# EAGLE design v2.0 Door (EAGLE 7.7.0)

## Sheet 1 of 2
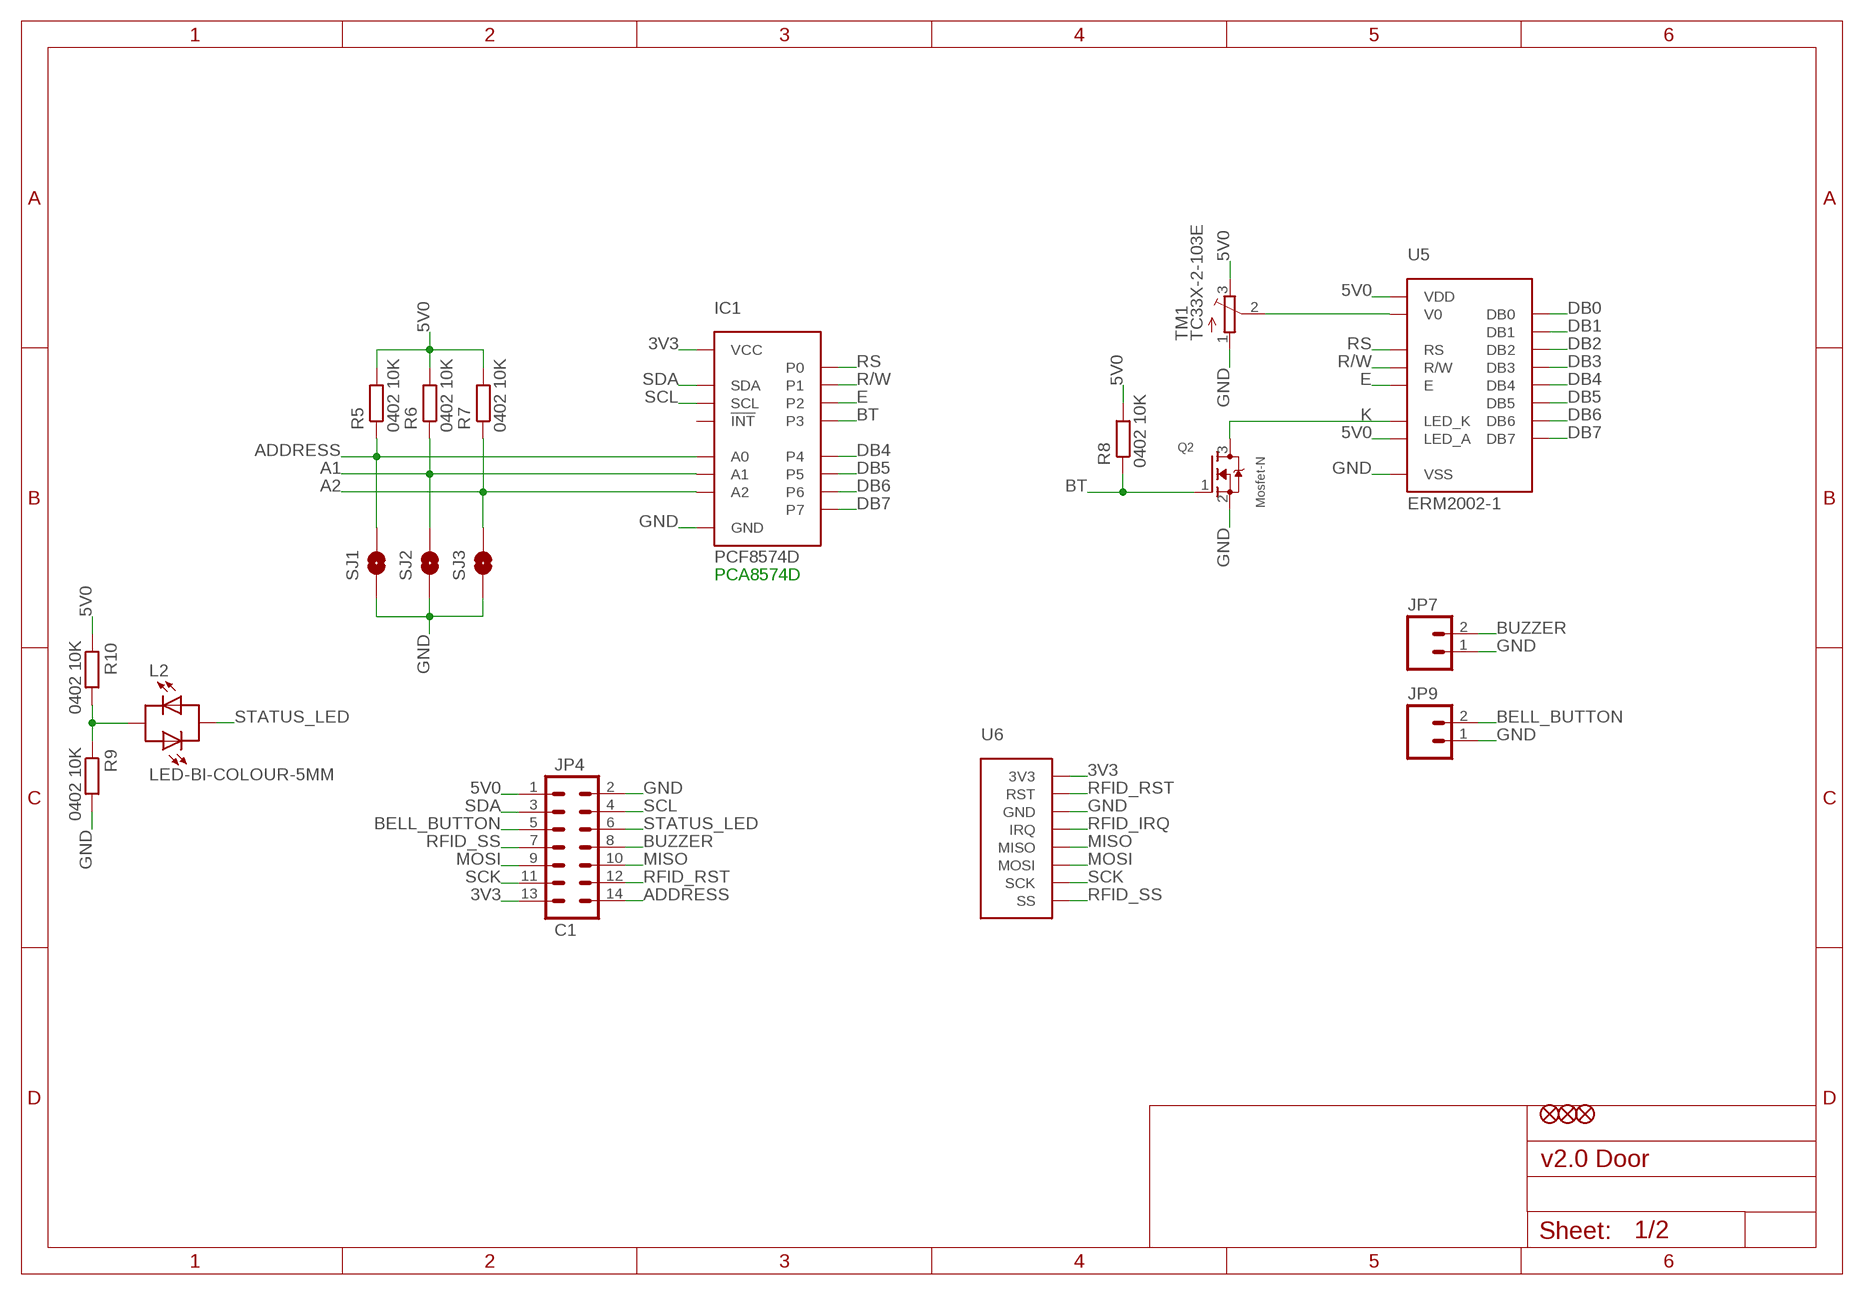
[diagram p0: schematic, sheet 1]

### Parts
IC1  PCF8574D  PCF8574  [SO16]
JP1  FIDUCIAL1X2.5-STOP  [FIDUCIAL-1X2.5-STOP]
JP2  FIDUCIAL1X2.5-STOP  [FIDUCIAL-1X2.5-STOP]
JP3  FIDUCIAL1X2.5-STOP  [FIDUCIAL-1X2.5-STOP]
JP4  C1  M07X2-SHOROUDED_LOCK  [2X7-SHROUDED_LOCK]
JP7  M02POLAR_LOCK  [MOLEX-1X2_LOCK]
JP9  M02POLAR_LOCK  [MOLEX-1X2_LOCK]
L2  LED-BI-COLOUR-5MM  [LED5MM]
Q2  Mosfet-N  MOSFET-N-SOT23-SPARK  [SOT23-3]
R5  0402 10K  R-EU_R0402-SMALLER  [R0402-SMALLER]
R6  0402 10K  R-EU_R0402-SMALLER  [R0402-SMALLER]
R7  0402 10K  R-EU_R0402-SMALLER  [R0402-SMALLER]
R8  0402 10K  R-EU_R0402-SMALLER  [R0402-SMALLER]
R9  0402 10K  R-EU_R0402-SMALLER  [R0402-SMALLER]
R10  0402 10K  R-EU_R0402-SMALLER  [R0402-SMALLER]
SJ1  SOLDERJUMPERNO  [SJ_2S-NO]
SJ2  SOLDERJUMPERNO  [SJ_2S-NO]
SJ3  SOLDERJUMPERNO  [SJ_2S-NO]
TM1  TC33X-2-103E  TRIMPOTTC33X  [TC33X]
U5  ERM2002-1  ERM2002-1-GATEKEEPER  [ERM2002-1-GATEKEEPER]
U6  RFID-RC522-GATEKEEPER  [RFID-RC522-GATEKEEPER]

### Nets
3V3: IC1.16(VCC) JP4.13 U6.8(3V3)
5V0: JP4.1 R5.2 R6.2 R7.2 R8.2 R10.1 TM1.3(E) U5.2(VDD) U5.15(LED_A)
A1: IC1.2(A1) R6.1 SJ2.2
A2: IC1.3(A2) R7.1 SJ3.2
ADDRESS: IC1.1(A0) JP4.14 R5.1 SJ1.2
BELL_BUTTON: JP4.5 JP9.2
BT: IC1.7(P3) Q2.1(G) R8.1
BUZZER: JP4.8 JP7.2
DB0: U5.7(DB0)
DB1: U5.8(DB1)
DB2: U5.9(DB2)
DB3: U5.10(DB3)
DB4: IC1.9(P4) U5.11(DB4)
DB5: IC1.10(P5) U5.12(DB5)
DB6: IC1.11(P6) U5.13(DB6)
DB7: IC1.12(P7) U5.14(DB7)
E: IC1.6(P2) U5.6(E)
GND: IC1.8(GND) JP4.2 JP7.1 JP9.1 Q2.2(S) R9.2 SJ1.1 SJ2.1 SJ3.1 TM1.1(A) U5.1(VSS) U6.6(GND) ; also sheet 2
K: Q2.3(D) U5.16(LED_K)
MISO: JP4.10 U6.4(MISO)
MOSI: JP4.9 U6.3(MOSI)
N$8: TM1.2(S) U5.3(V0)
N$9: L2.A R9.1 R10.2
R/W: IC1.5(P1) U5.5(R/W)
RFID_IRQ: U6.5(IRQ)
RFID_RST: JP4.12 U6.7(RST)
RFID_SS: JP4.7 U6.1(SS)
RS: IC1.4(P0) U5.4(RS)
SCK: JP4.11 U6.2(SCK)
SCL: IC1.14(SCL) JP4.4
SDA: IC1.15(SDA) JP4.3
STATUS_LED: JP4.6 L2.K
Unconnected: IC1.13(!INT)

### Notes on the sheet
- PCA8574D

## Sheet 2 of 2
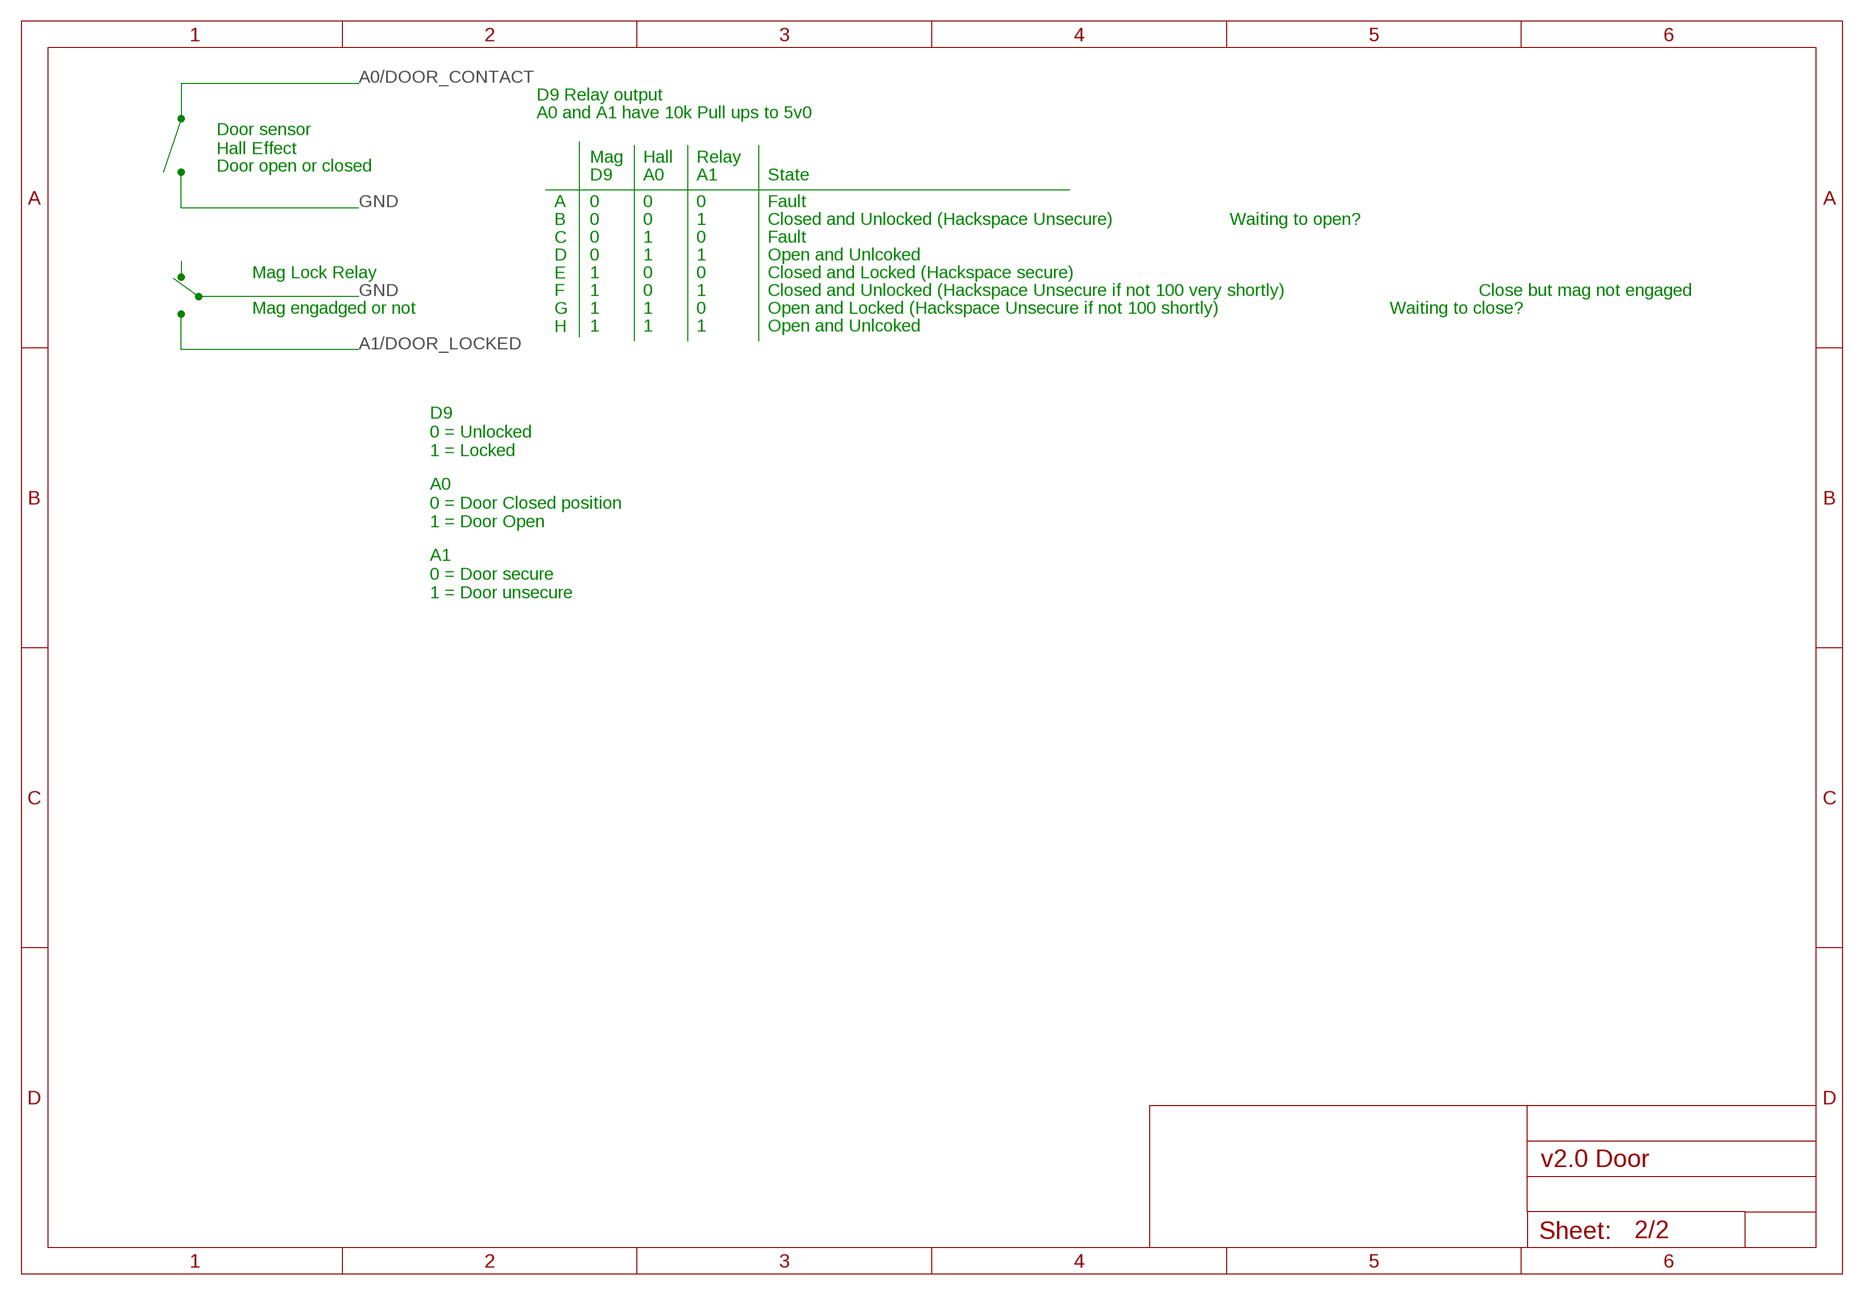
[diagram p1: schematic, sheet 2]

### Notes on the sheet
- D9 Relay output
- A0 and A1 have 10k Pull ups to 5v0
- Door sensor
  Hall Effect
- Mag | Hall | Relay
- Door open or closed
- D9 | A0 | A1 | State
- 0 | 0 | 0 | Fault
- 0 | 0 | 1 | Closed and Unlocked (Hackspace Unsecure) | Waiting to open?
- 0 | 1 | 0 | Fault
- 0 | 1 | 1 | Open and Unlcoked
- Mag Lock Relay | 1 | 0 | 0 | Closed and Locked (Hackspace secure)
- 1 | 0 | 1 | Closed and Unlocked (Hackspace Unsecure if not 100 very shortly) | Close but mag not engaged
- Mag engadged or not | 1 | 1 | 0 | Open and Locked (Hackspace Unsecure if not 100 shortly) | Waiting to close?
- A
  B
  C
  D
  E
  F
  G
  H
- 1 | 1 | 1 | Open and Unlcoked
- D9
  0 = Unlocked
  1 = Locked
- A0
  0 = Door Closed position
  1 = Door Open
- A1
  0 = Door secure
  1 = Door unsecure

## Library data of the parts
IC1 = CISECO eaglecad designs:PCF8574
JP1-JP3 = CISECO eaglecad designs:FIDUCIAL: Fiducial Alignment Points Various fiducial points for machine vision alignment.
JP4 = CISECO eaglecad designs:M07X2
JP7 JP9 = CISECO eaglecad designs:M02: Header 2 Standard 2-pin 0.1" header. Use with straight break away headers (SKU : PRT-00116), right angle break away headers (PRT-00553), swiss pins (PRT-00743), machine pins (PRT-00117), and female headers (PRT-00115). Molex polarized connector foot print use with SKU : PRT-08233 with associated crimp pins and housings.
L2 = CISECO eaglecad designs:LED-BI-COLOUR
Q2 = TiLDA Mk2 Parts:MOSFET-N: N-Channel Mosfet 2N7002E - 60V 260mA SOT23 [Digikey: 2N7002ET1GOSTR-ND] - REEL BSH103 - 30V 850mA SOT23 [Digikey: 568-5013-1-ND]
R5-R10 = CISECO eaglecad designs:R-EU_: RESISTOR, European symbol
SJ1-SJ3 = CISECO eaglecad designs:SOLDERJUMPER: Solder Jumper Standard SMD solder jumper. Used to automate production. Two varients : Normally Open and Normally Closed are the same, but have different paste layers. NC will have a large amount of paste and should jumper during reflow.
TM1 = adafruit 161207:TRIMPOT: SMT trimmer potentiometer part number TC33X http://www.ladyada.net/library/eagle
U5 = CISECO eaglecad designs:ERM2002-1
U6 = CISECO eaglecad designs:RFID-RC522

## Net classes
2 MAINS: clearance 4 mm

## Board
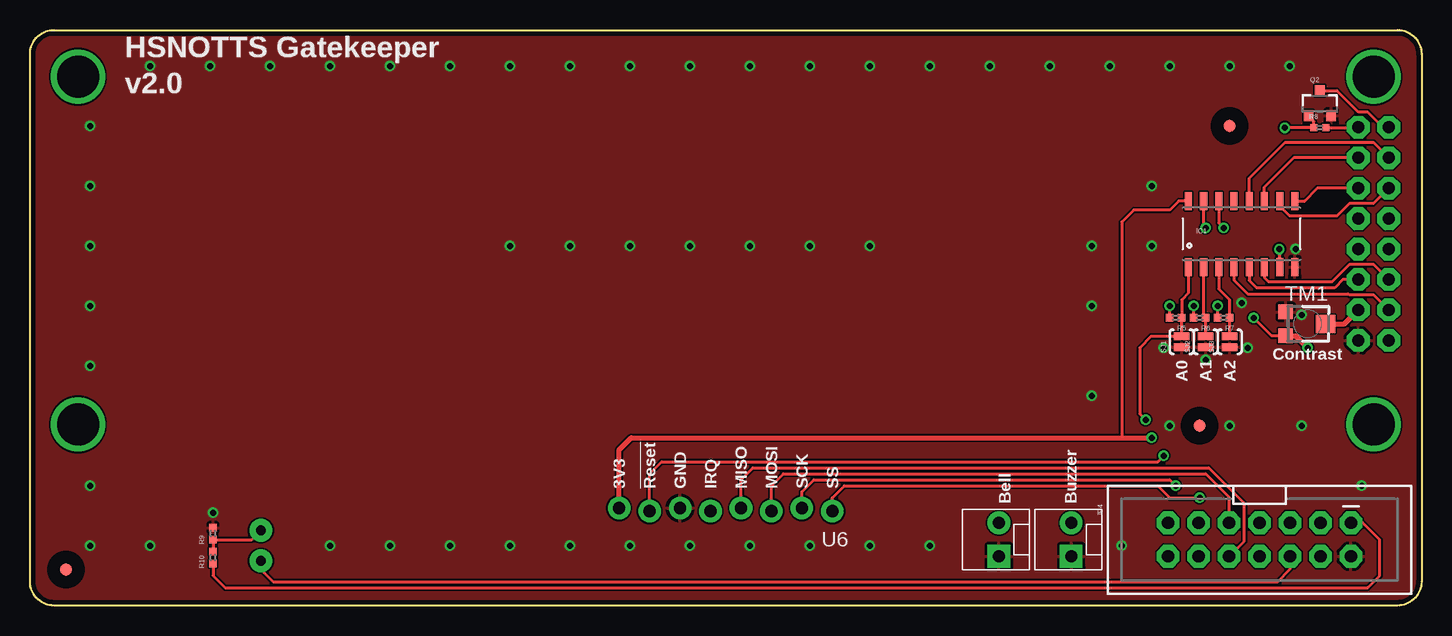
[diagram p2: board, top side]
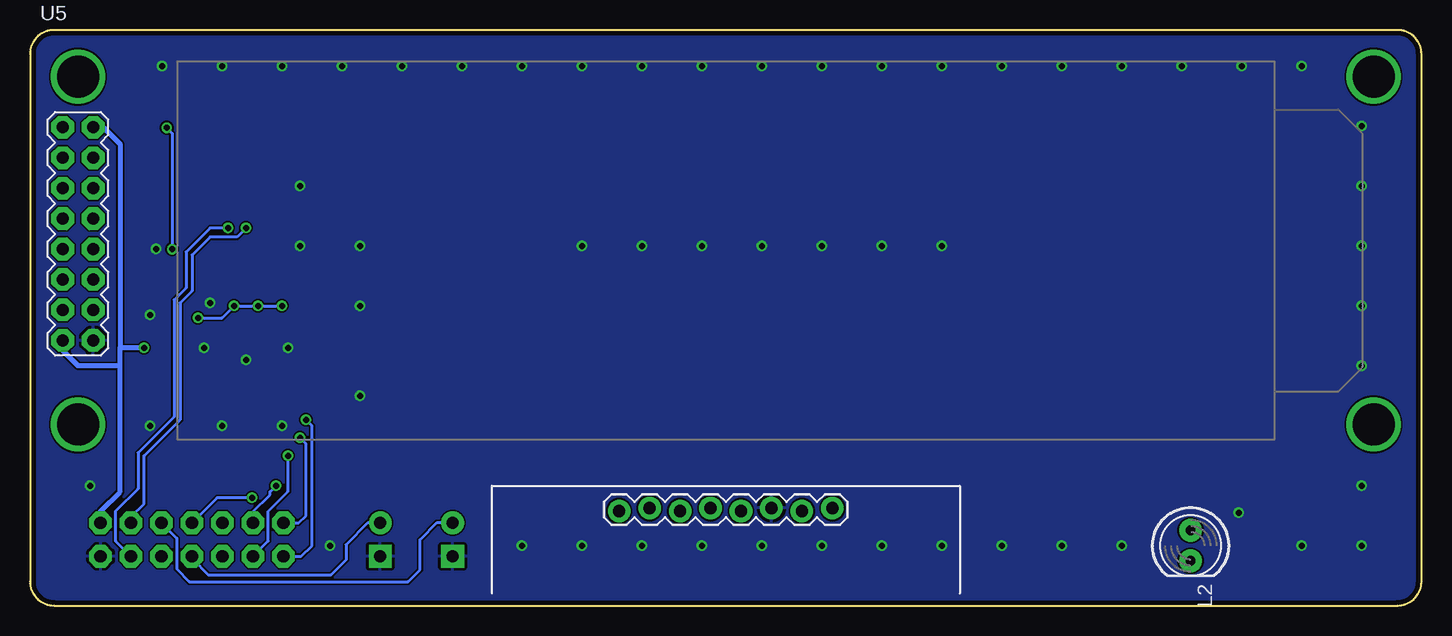
[diagram p3: board, bottom side, seen from below]

Size 116 x 48 mm. Coordinates in mm from the lower left corner, seen from the top.
Outline: 114,0 2,0 arc-90 0,2 0,46 arc-90 2,48 114,48 arc-90 116,46 116,2 arc-90 114,0
Copper layers (1*16): Top 0.0356mm / dielectric 1.5011mm / Bottom 0.0356mm
Design rules "default *": minimum track width 6mil, minimum drill 13mil, track to track 6mil, track to pad 6mil, pad to pad 6mil, via to via 6mil, smd to smd 6mil, copper to edge 15mil, drill to drill 6mil, minimum pad ring 7mil, minimum via ring 7mil, stop-mask expansion 3mil, vias tented up to drill 23mil, thermal gap 10mil

### Footprints (pad centres in the part's own frame; a part is rotated, then mirrored left to right if it is on the bottom)
SO16 = smd 0.6 x 1.5: 1 -4.445,-2.75; 2 -3.175,-2.75; 3 -1.905,-2.75; 4 -0.635,-2.75; 5 0.635,-2.75; 6 1.905,-2.75; 7 3.175,-2.75; 8 4.445,-2.75; 9 4.445,2.75; 10 3.175,2.75; 11 1.905,2.75; 12 0.635,2.75; 13 -0.635,2.75; 14 -1.905,2.75; 15 -3.175,2.75; 16 -4.445,2.75
FIDUCIAL-1X2.5-STOP = smd 1 x 1: 1 0,0
2X7-SHROUDED_LOCK = drill 1.016 pad 1.88 octagon: 1 -7.62,-1.397; 2 -7.62,1.397; 3 -5.08,-1.397; 4 -5.08,1.397; 5 -2.54,-1.397; 6 -2.54,1.397; 7 0,-1.397; 8 0,1.397; 9 2.54,-1.397; 10 2.54,1.397; 11 5.08,-1.397; 12 5.08,1.397; 13 7.62,-1.397; 14 7.62,1.397
MOLEX-1X2_LOCK = drill 1.016 pad 1.88 square: 1 -0.127,0 | drill 1.016 pad 1.88: 2 2.667,0
LED5MM = drill 0.813 pad 1.88: A -1.27,0; K 1.27,0
SOT23-3 = smd 0.8 x 0.9: 1 -0.95,-1; 2 0.95,-1; 3 0,1.1
R0402-SMALLER = smd 0.6 x 0.6: 1 -0.5,0; 2 0.5,0
SJ_2S-NO = smd 0.635 x 1.27: 1 -0.45,0; 2 0.45,0
TC33X = smd 1.2 x 1.2: 1 -1,-1.825; 3 1,-1.825 | smd 1.5 x 1.6: 2 0,1.5
ERM2002-1-GATEKEEPER = drill 1.016 pad 1.88 octagon: 1 1.27,-8.89; 2 -1.27,-8.89; 3 1.27,-6.35; 4 -1.27,-6.35; 5 1.27,-3.81; 6 -1.27,-3.81; 7 1.27,-1.27; 8 -1.27,-1.27; 9 1.27,1.27; 10 -1.27,1.27; 11 1.27,3.81; 12 -1.27,3.81; 13 1.27,6.35; 14 -1.27,6.35; 15 1.27,8.89; 16 -1.27,8.89 | drill 3.5: P$1 0,-15.89; P$2 108,13.11; P$3 108,-15.89; P$4 0,13.11
RFID-RC522-GATEKEEPER = drill 1.016 pad 1.88: 1 -8.89,0.127; 2 -6.35,-0.127; 3 -3.81,0.127; 4 -1.27,-0.127; 5 1.27,0.127; 6 3.81,-0.127; 7 6.35,0.127; 8 8.89,-0.127

### Placement (x,y rotation side)
IC1  101,31 0 top
JP1  3,3 0 top
JP2  97.5,15 0 top
JP3  100,40 0 top
JP4  102.5,5.5 180 top
JP7  86.81,4.23 90 top
JP9  80.77,4.23 90 top
L2  19.25,5 270 bottom
Q2  107.52,41.84 0 top
R5  95.5,24 180 top
R6  97.5,24 180 top
R7  99.5,24 180 top
R8  107.52,39.84 0 top
R9  15.25,6 90 top
R10  15.25,4 90 top
SJ1  96,22 90 top
SJ2  98,22 90 top
SJ3  100,22 90 top
TM1  106.5,23.5 270 top
U5  112,31 0 bottom
U6  58,8 180 top

### Tracks (layer width: path | path; a pad name or v marks a point on that pad's centre or on a via)
3V3  (via drill 0.5)
  Top 0.254: IC1.16 95.75,33.75 95,33 92,33 91,32 91,14
  Top 0.406: U6.8 49.11,13 50.11,14 91,14 v93.5,14
  Bottom 0.254: JP4.13 93.6,6.9 93,7.5 93,13.5 v93.5,14
5V0  (via drill 0.5)
  Top 0.254: R8.2 110.68,39.84 U5.15 | R6.2 v97,25 | R7.2 v99,25 | R5.2 v95,25 | TM1.3 103.5,22.5 v102,24 | R10.1 15.25,2.5 16.25,1.5 111.5,1.5 112.5,2.5 112.5,5.5 111.1,6.9 JP4.1
  Top 0.406: TM1.3 105.5,22.5 v106.5,21.5
  Bottom 0.254: v102,24 100,24 v99,25 v97,25 v95,25
  Bottom 0.406: 108.5,21.5 108.5,38.5 109.84,39.84 110.68,39.84 U5.15 | 108.5,20 112,20 113.27,21.27 U5.2 | v106.5,21.5 108.5,21.5 | JP4.1 110.12,7.88 108.5,9.5 108.5,20 | 108.5,20 108.5,21.5
A1
  Top 0.254: SJ2.2 R6.1 97.83,24.18 IC1.2
A2
  Top 0.254: SJ3.2 R7.1 100,25.5 99.09,26.41 IC1.3
ADDRESS  (via drill 0.5)
  Top 0.254: IC1.1 96.56,26.05 96,25.5 R5.1 SJ1.2 93.45,22.45 92.5,21.5 92.5,16 v93,15.5
  Bottom 0.254: JP4.14 93.4,4.1 92.5,5 92.5,15 v93,15.5
BELL_BUTTON
  Bottom 0.25: JP9.2 82.1,6.9 83.5,5.5
  Bottom 0.254: JP4.5 103.76,5.61 103.76,3.05 102.71,2 84.5,2 83.5,3 83.5,5.5
BT  (via drill 0.5)
  Top 0.254: Q2.1 107.02,40.39 R8.1 v104.61,39.84 | v104.14,29.72 104.14,28.29 IC1.7
  Bottom 0.254: v104.61,39.84 104.14,39.37 v104.14,29.72
BUZZER
  Bottom 0.25: JP7.2 87.84,6.9 89.66,5.08
  Bottom 0.254: 89.66,5.08 89.66,3.81 90.93,2.54 101.09,2.54 102.5,3.95 JP4.8
DB4
  Top 0.254: IC1.9 106.25,33.75 107.31,34.81 U5.11
DB5
  Top 0.254: U5.12 111.99,33.53 109.98,33.53 108.95,32.5 105,32.5 104.17,33.33 IC1.10
DB6
  Top 0.254: U5.13 105.35,37.35 102.91,34.91 IC1.11
DB7
  Top 0.254: U5.14 112.01,38.61 104.61,38.61 101.64,35.63 IC1.12
E
  Top 0.254: U5.6 112.01,28.45 109.98,28.45 108.53,27 103.25,27 102.91,27.34 IC1.6
GND  (via drill 0.5)
  other vias: 105.5,29.75 98,20.5 94.5,21.5 101.5,21.5 101,25.25 106,24.25 15.25,7.75 5,5 5,10 5,20 5,25 5,30 5,35 5,40 10,45 30,45 35,45 70,30 65,30 60,30 55,30 50,30 45,30 40,30 70,45 65,45 60,45 55,45 50,45 45,45 40,45 105,45 100,45 95,45 90,45 85,45 80,45 75,45 91,5 75,5 70,5 65,5 60,5 55,5 50,5 45,5 40,5 35,5 30,5 111,10 100,15 106,15 95,15 93.5,30 93.5,35 88.5,30 88.5,25 88.5,17.5 15,45 20,45 25,45 25,5 10,5
  pour Bottom: 0,46 0,2 arc90 2,0 114,0 arc90 116,2 116,46 arc90 114,48 2,48 arc90
  pour Top: 0,46 0,2 arc90 2,0 114,0 arc90 116,2 116,46 arc90 114,48 2,48 arc90
K
  Top 0.254: U5.16 112.76,39.89 111.5,41.15 110.74,41.15 108.95,42.94 Q2.3
MISO
  Top 0.254: U6.4 59.27,10.5 60.27,11.5 98.25,11.5 101.22,8.53 101.22,5.36 JP4.10
MOSI
  Top 0.254: U6.3 61.81,10 62.81,11 98,11 99.96,9.04 JP4.9
N$8
  Top 0.406: TM1.2 109.58,23.5 U5.3
N$9
  Top 0.254: R10.2 R9.1 18.48,5.5 L2.A
R/W
  Top 0.254: U5.5 109.44,27.19 108.75,26.5 102.25,26.5 101.64,27.11 IC1.5
RFID_RST  (via drill 0.5)
  Top 0.254: U6.7 51.65,11 52.65,12 94,12 v94.5,12.5
  Bottom 0.254: JP4.12 96.14,5.39 96.14,7.87 94.5,9.51 v94.5,12.5
RFID_SS  (via drill 0.5)
  Top 0.254: U6.1 66.89,9 67.89,10 94,10 95,9 v97.5,9
  Bottom 0.254: v97.5,9 100.4,9 JP4.7
RS
  Top 0.254: IC1.4 100.36,27.14 101.5,26 109.89,26 109.98,25.91 112.01,25.91 U5.4
SCK  (via drill 0.5)
  Top 0.254: U6.2 64.35,9.5 65.35,10.5 95,10.5 v95.5,10
  Bottom 0.254: JP4.11 97.42,7.83 96,9.25 96,9.5 v95.5,10
SCL  (via drill 0.5)
  Top 0.254: IC1.14 99.09,31.91 v99.5,31.5
  Bottom 0.254: v99.5,31.5 101,31.5 103,29.5 103,26.5 104,25.5 104,15.75 107,12.75 107,9.75 108.84,7.91 108.84,5.36 JP4.4
SDA  (via drill 0.5)
  Top 0.254: IC1.15 97.83,31.68 v98,31.5
  Bottom 0.254: v98,31.5 98.75,30.75 101,30.75 102.5,29.25 102.5,26.25 103.5,25.25 103.5,15.5 106.5,12.5 106.5,8.5 107.58,7.42 JP4.3
STATUS_LED
  Top 0.254: L2.K 19.25,3 20.25,2 104,2 105.04,3.04 JP4.6

### Text on the board
tPlace: HSNOTTS Gatekeeper | v2.0 | Contrast | A0 | A1 | A2 | 3V3 | !Reset | GND | IRQ | MISO | MOSI | SCK | SS | Bell | Buzzer